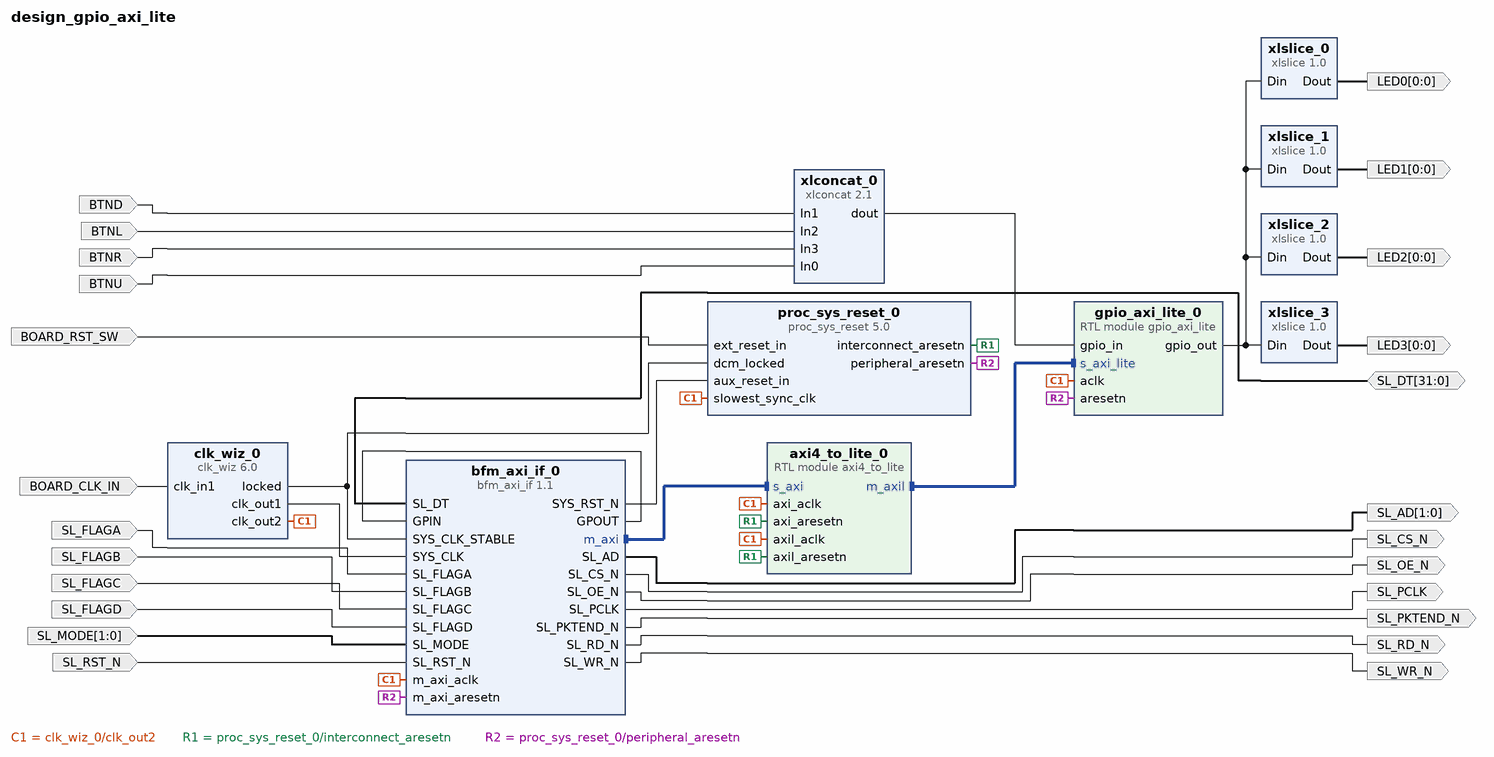
[diagram p0: block diagram of the top level]
# Vivado block design design_gpio_axi_lite, xc7z020clg484-1, Vivado 2021.2
create_bd_design design_gpio_axi_lite

create_bd_port -dir I -type clk BOARD_CLK_IN
set_property -dict {CONFIG.FREQ_HZ 100000000} [get_bd_ports BOARD_CLK_IN]
create_bd_port -dir I -type rst BOARD_RST_SW
set_property -dict {CONFIG.POLARITY ACTIVE_HIGH} [get_bd_ports BOARD_RST_SW]
create_bd_port -dir I BTND
create_bd_port -dir I BTNL
create_bd_port -dir I BTNR
create_bd_port -dir I BTNU
create_bd_port -dir O -from 0 -to 0 LED0
create_bd_port -dir O -from 0 -to 0 LED1
create_bd_port -dir O -from 0 -to 0 LED2
create_bd_port -dir O -from 0 -to 0 LED3
create_bd_port -dir O -from 1 -to 0 SL_AD
create_bd_port -dir O SL_CS_N
create_bd_port -dir IO -from 31 -to 0 SL_DT
create_bd_port -dir I SL_FLAGA
create_bd_port -dir I SL_FLAGB
create_bd_port -dir I SL_FLAGC
create_bd_port -dir I SL_FLAGD
create_bd_port -dir I -from 1 -to 0 SL_MODE
create_bd_port -dir O SL_OE_N
create_bd_port -dir O SL_PCLK
create_bd_port -dir O SL_PKTEND_N
create_bd_port -dir O SL_RD_N
create_bd_port -dir I -type rst SL_RST_N
create_bd_port -dir O SL_WR_N

create_bd_cell -type module -reference axi4_to_lite axi4_to_lite_0
create_bd_cell -type ip -vlnv future-ds.com:user:bfm_axi_if:1.1 bfm_axi_if_0
create_bd_cell -type ip -vlnv xilinx.com:ip:clk_wiz:6.0 clk_wiz_0
set_property -dict [list \
  CONFIG.CLKOUT1_JITTER 137.143 \
  CONFIG.CLKOUT1_PHASE_ERROR 98.575 \
  CONFIG.CLKOUT1_REQUESTED_OUT_FREQ 80 \
  CONFIG.CLKOUT2_JITTER 130.958 \
  CONFIG.CLKOUT2_PHASE_ERROR 98.575 \
  CONFIG.CLKOUT2_USED true \
  CONFIG.CLKOUT3_JITTER 127.220 \
  CONFIG.CLKOUT3_PHASE_ERROR 105.461 \
  CONFIG.CLKOUT3_REQUESTED_OUT_FREQ 100.000 \
  CONFIG.CLKOUT3_USED false \
  CONFIG.MMCM_CLKFBOUT_MULT_F 10.000 \
  CONFIG.MMCM_CLKOUT0_DIVIDE_F 12.500 \
  CONFIG.MMCM_CLKOUT1_DIVIDE 10 \
  CONFIG.MMCM_CLKOUT2_DIVIDE 1 \
  CONFIG.NUM_OUT_CLKS 2 \
  CONFIG.USE_RESET false \
] [get_bd_cells clk_wiz_0]
create_bd_cell -type module -reference gpio_axi_lite gpio_axi_lite_0
set_property -dict {CONFIG.P_WIDTH 4} [get_bd_cells gpio_axi_lite_0]
create_bd_cell -type ip -vlnv xilinx.com:ip:proc_sys_reset:5.0 proc_sys_reset_0
create_bd_cell -type ip -vlnv xilinx.com:ip:xlconcat:2.1 xlconcat_0
set_property -dict {CONFIG.NUM_PORTS 4} [get_bd_cells xlconcat_0]
create_bd_cell -type ip -vlnv xilinx.com:ip:xlslice:1.0 xlslice_0
set_property -dict {CONFIG.DIN_WIDTH 4} [get_bd_cells xlslice_0]
create_bd_cell -type ip -vlnv xilinx.com:ip:xlslice:1.0 xlslice_1
set_property -dict {CONFIG.DIN_FROM 1 CONFIG.DIN_TO 1 CONFIG.DIN_WIDTH 4 CONFIG.DOUT_WIDTH 1} [get_bd_cells xlslice_1]
create_bd_cell -type ip -vlnv xilinx.com:ip:xlslice:1.0 xlslice_2
set_property -dict {CONFIG.DIN_FROM 2 CONFIG.DIN_TO 2 CONFIG.DIN_WIDTH 4 CONFIG.DOUT_WIDTH 1} [get_bd_cells xlslice_2]
create_bd_cell -type ip -vlnv xilinx.com:ip:xlslice:1.0 xlslice_3
set_property -dict {CONFIG.DIN_FROM 3 CONFIG.DIN_TO 3 CONFIG.DIN_WIDTH 4 CONFIG.DOUT_WIDTH 1} [get_bd_cells xlslice_3]

# ---- connections ----

connect_bd_intf_net [get_bd_intf_pins axi4_to_lite_0/m_axil] [get_bd_intf_pins gpio_axi_lite_0/s_axi_lite]
connect_bd_intf_net [get_bd_intf_pins axi4_to_lite_0/s_axi] [get_bd_intf_pins bfm_axi_if_0/m_axi]
connect_bd_net [get_bd_ports BOARD_CLK_IN] [get_bd_pins clk_wiz_0/clk_in1]
connect_bd_net [get_bd_ports BOARD_RST_SW] [get_bd_pins proc_sys_reset_0/ext_reset_in]
connect_bd_net [get_bd_ports BTND] [get_bd_pins xlconcat_0/In1]
connect_bd_net [get_bd_ports BTNL] [get_bd_pins xlconcat_0/In2]
connect_bd_net [get_bd_ports BTNR] [get_bd_pins xlconcat_0/In3]
connect_bd_net [get_bd_ports BTNU] [get_bd_pins xlconcat_0/In0]
connect_bd_net [get_bd_ports SL_DT] [get_bd_pins bfm_axi_if_0/SL_DT]
connect_bd_net -net SL_FLAGA_0_1 [get_bd_ports SL_FLAGA] [get_bd_pins bfm_axi_if_0/SL_FLAGA]
connect_bd_net -net SL_FLAGB_0_1 [get_bd_ports SL_FLAGB] [get_bd_pins bfm_axi_if_0/SL_FLAGB]
connect_bd_net -net SL_FLAGC_0_1 [get_bd_ports SL_FLAGC] [get_bd_pins bfm_axi_if_0/SL_FLAGC]
connect_bd_net -net SL_FLAGD_0_1 [get_bd_ports SL_FLAGD] [get_bd_pins bfm_axi_if_0/SL_FLAGD]
connect_bd_net -net SL_MODE_0_1 [get_bd_ports SL_MODE] [get_bd_pins bfm_axi_if_0/SL_MODE]
connect_bd_net -net SL_RST_N_0_1 [get_bd_ports SL_RST_N] [get_bd_pins bfm_axi_if_0/SL_RST_N]
connect_bd_net [get_bd_pins bfm_axi_if_0/GPOUT] [get_bd_pins bfm_axi_if_0/GPIN]
connect_bd_net [get_bd_pins bfm_axi_if_0/SL_AD] [get_bd_ports SL_AD]
connect_bd_net [get_bd_pins bfm_axi_if_0/SL_CS_N] [get_bd_ports SL_CS_N]
connect_bd_net [get_bd_pins bfm_axi_if_0/SL_OE_N] [get_bd_ports SL_OE_N]
connect_bd_net [get_bd_pins bfm_axi_if_0/SL_PCLK] [get_bd_ports SL_PCLK]
connect_bd_net [get_bd_pins bfm_axi_if_0/SL_PKTEND_N] [get_bd_ports SL_PKTEND_N]
connect_bd_net [get_bd_pins bfm_axi_if_0/SL_RD_N] [get_bd_ports SL_RD_N]
connect_bd_net [get_bd_pins bfm_axi_if_0/SL_WR_N] [get_bd_ports SL_WR_N]
connect_bd_net [get_bd_pins clk_wiz_0/clk_out1] [get_bd_pins bfm_axi_if_0/SYS_CLK]
connect_bd_net [get_bd_pins clk_wiz_0/clk_out2] \
  [get_bd_pins axi4_to_lite_0/axi_aclk] [get_bd_pins axi4_to_lite_0/axil_aclk] [get_bd_pins bfm_axi_if_0/m_axi_aclk] \
  [get_bd_pins gpio_axi_lite_0/aclk] [get_bd_pins proc_sys_reset_0/slowest_sync_clk]
connect_bd_net [get_bd_pins clk_wiz_0/locked] [get_bd_pins bfm_axi_if_0/SYS_CLK_STABLE] [get_bd_pins proc_sys_reset_0/dcm_locked]
connect_bd_net [get_bd_pins gpio_axi_lite_0/gpio_out] \
  [get_bd_pins xlslice_0/Din] [get_bd_pins xlslice_1/Din] [get_bd_pins xlslice_2/Din] [get_bd_pins xlslice_3/Din]
connect_bd_net [get_bd_pins proc_sys_reset_0/interconnect_aresetn] [get_bd_pins axi4_to_lite_0/axi_aresetn] [get_bd_pins axi4_to_lite_0/axil_aresetn]
connect_bd_net [get_bd_pins proc_sys_reset_0/peripheral_aresetn] [get_bd_pins bfm_axi_if_0/m_axi_aresetn] [get_bd_pins gpio_axi_lite_0/aresetn]
connect_bd_net -net util_vector_logic_0_Res [get_bd_pins bfm_axi_if_0/SYS_RST_N] [get_bd_pins proc_sys_reset_0/aux_reset_in]
connect_bd_net [get_bd_pins xlconcat_0/dout] [get_bd_pins gpio_axi_lite_0/gpio_in]
connect_bd_net [get_bd_pins xlslice_0/Dout] [get_bd_ports LED0]
connect_bd_net [get_bd_pins xlslice_1/Dout] [get_bd_ports LED1]
connect_bd_net [get_bd_pins xlslice_2/Dout] [get_bd_ports LED2]
connect_bd_net [get_bd_pins xlslice_3/Dout] [get_bd_ports LED3]

# ---- address map ----
assign_bd_address -offset 0xC0050000 -range 8K -target_address_space [get_bd_addr_spaces axi4_to_lite_0/m_axil] [get_bd_addr_segs gpio_axi_lite_0/s_axi_lite/reg0]
assign_bd_address -offset 0x00000000 -range 4G -target_address_space [get_bd_addr_spaces bfm_axi_if_0/m_axi] [get_bd_addr_segs axi4_to_lite_0/s_axi/reg0]

validate_bd_design
save_bd_design
